# Altium schematic sheet multi-rc522.SchDoc
size A4
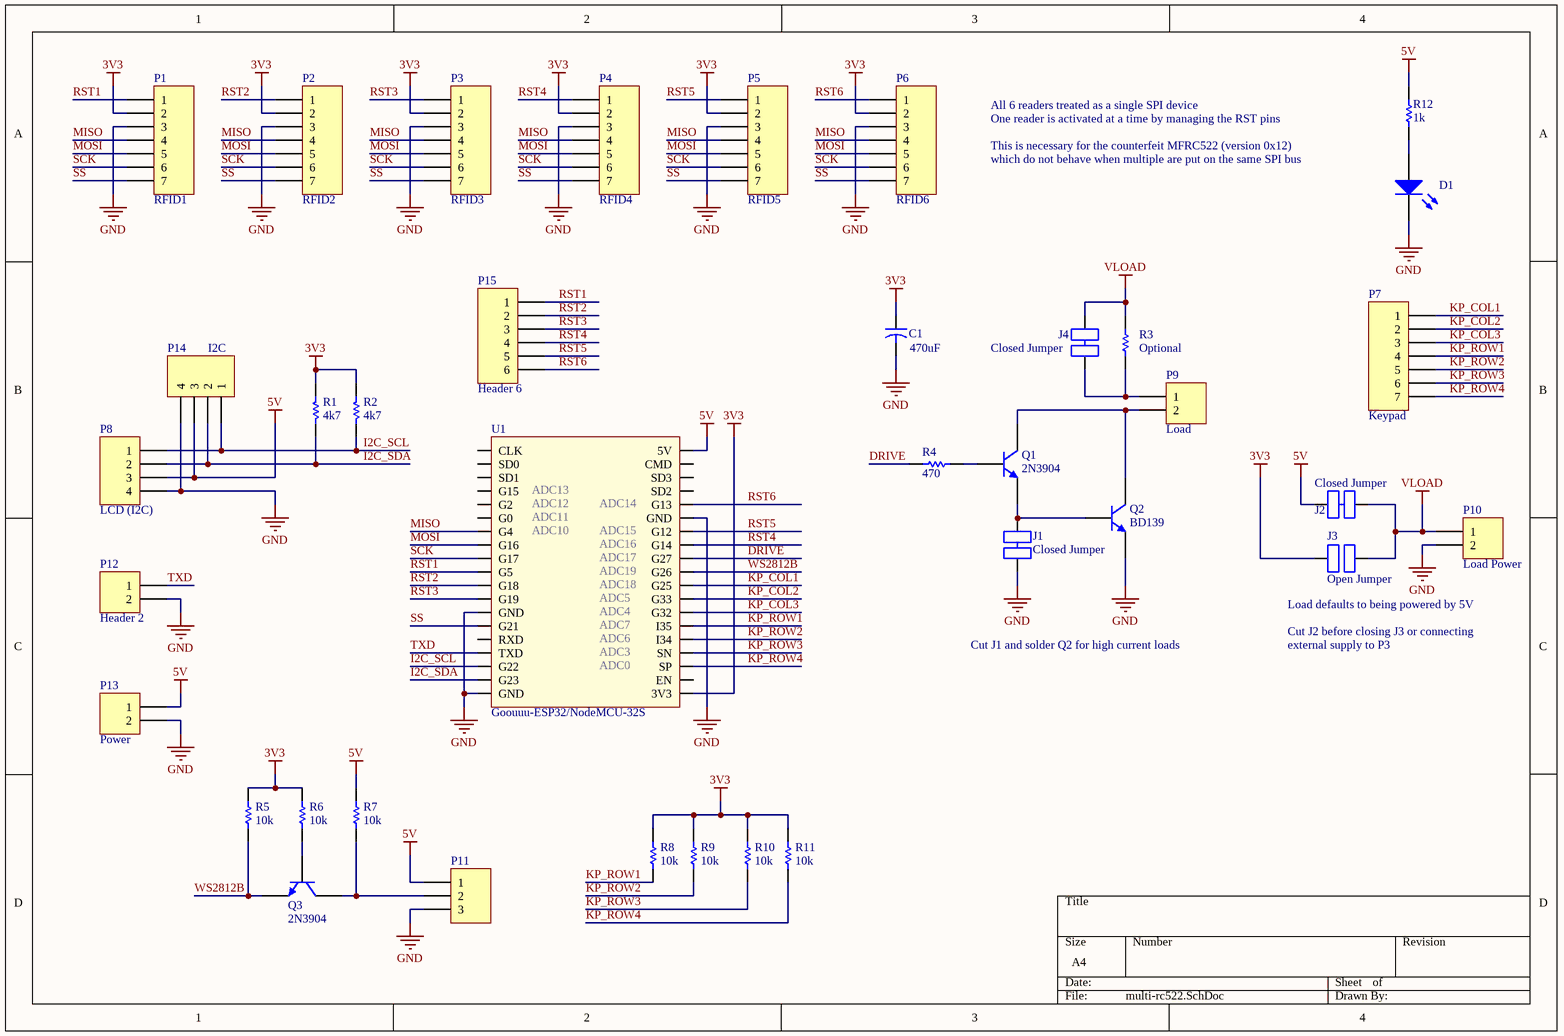
[diagram p0: multi-rc522.SchDoc]

## Parts
C1  value 470uF  [CAPR5-4X5]  (hidden comment: Cap2)
D1  LED  [LED]  (value not drawn)
J1  Closed Jumper  [Jumper (Close)]  (net tie, no BOM)
J2  Closed Jumper  [Jumper (Close)]  (net tie, no BOM)
J3  Open Jumper  [Jumper (Open)]  (no BOM)
J4  Closed Jumper  [Jumper (Close)]  (net tie, no BOM)
P1  RFID1  [HDR1X7]
P2  RFID2  [HDR1X7]
P3  RFID3  [HDR1X7]
P4  RFID4  [HDR1X7]
P5  RFID5  [HDR1X7]
P6  RFID6  [HDR1X7]
P7  Keypad  [HDR1X7]
P8  LCD (I2C)  [HDR1X4]
P9  Load  [RAD-0.2]
P10  Load Power  [RAD-0.2]
P11  Header 3  [HDR1X3]  (value not drawn)
P12  Header 2  [HDR1X2]
P13  Power  [RAD-0.2]
P14  I2C  [HDR1X4]
P15  Header 6  [HDR1X6]
Q1  2N3904  [TO-92A]
Q2  BD139  [TO-220-AB]
Q3  2N3904  [TO-92A]
R1  value 4k7  [AXIAL-0.4]  (hidden comment: Res1)
R2  value 4k7  [AXIAL-0.4]  (hidden comment: Res1)
R3  Optional  [AXIAL-0.4]
R4  value 470  [AXIAL-0.4]  (hidden comment: Res1)
R5  value 10k  [RAD-0.1]  (hidden comment: Res1)
R6  value 10k  [RAD-0.1]  (hidden comment: Res1)
R7  value 10k  [RAD-0.1]  (hidden comment: Res1)
R8  value 10k  [RAD-0.1]  (hidden comment: Res1)
R9  value 10k  [RAD-0.1]  (hidden comment: Res1)
R10  value 10k  [RAD-0.1]  (hidden comment: Res1)
R11  value 10k  [RAD-0.1]  (hidden comment: Res1)
R12  value 1k  [AXIAL-0.4]  (hidden comment: Res1)
U1  Goouuu-ESP32/NodeMCU-32S  [ESP32]

## Nets
3V3: C1.1 J3.1 P1.2 P2.2 P3.2 P4.2 P5.2 P6.2 R1.2 R2.2 R5.2 R6.2 R8.2 R9.2 R10.2 R11.2 U1.20(3V3)
5V: J2.1 P8.3 P11.1 P13.1 P14.3 R7.2 R12.1 U1.38(5V)
GND: C1.2 D1.2(K) J1.2 P1.3 P2.3 P3.3 P4.3 P5.3 P6.3 P8.4 P10.2 P11.3 P12.2 P13.2 P14.4 Q2.1(E) U1.13(GND) U1.19(GND) U1.33(GND)
VLOAD: J2.2 J3.2 J4.2 P10.1 R3.1
DRIVE: R4.2 U1.30(G27)
I2C_SCL: P8.1 P14.1 R2.1 U1.17(G22)
I2C_SDA: P8.2 P14.2 R1.1 U1.18(G23)
KP_COL1: P7.1 U1.28(G25)
KP_COL2: P7.2 U1.27(G33)
KP_COL3: P7.3 U1.26(G32)
KP_ROW1: P7.4 R8.1 U1.25(I35)
KP_ROW2: P7.5 R9.1 U1.24(I34)
KP_ROW3: P7.6 R10.1 U1.23(SN)
KP_ROW4: P7.7 R11.1 U1.22(SP)
MISO: P1.4 P2.4 P3.4 P4.4 P5.4 P6.4 U1.7(G4)
MOSI: P1.5 P2.5 P3.5 P4.5 P5.5 P6.5 U1.8(G16)
RST1: P1.1 P15.1 U1.10(G5)
RST2: P2.1 P15.2 U1.11(G18)
RST3: P3.1 P15.3 U1.12(G19)
RST4: P4.1 P15.4 U1.31(G14)
RST5: P5.1 P15.5 U1.32(G12)
RST6: P6.1 P15.6 U1.34(G13)
SCK: P1.6 P2.6 P3.6 P4.6 P5.6 P6.6 U1.9(G17)
SS: P1.7 P2.7 P3.7 P4.7 P5.7 P6.7 U1.14(G21)
TXD: P12.1 U1.16(TXD)
WS2812B: Q3.1(E) R5.1 U1.29(G26)
NetD1_1: D1.1(A) R12.2
NetJ1_1: J1.1 Q1.1(E) Q2.2(B)
NetJ4_1: J4.1 P9.1 R3.2
NetP9_2: P9.2 Q1.3(C) Q2.3(C)
NetP11_2: P11.2 Q3.3(C) R7.1
NetQ1_2: Q1.2(B) R4.1
NetQ3_2: Q3.2(B) R6.1

Not connected (* = marked no-connect by the designer): U1 1(CLK) 2(SD0) 3(SD1) 4(G15) 5(G2) 6(G0) 15(RXD) 21(EN) 35(SD2) 36(SD3) 37(CMD)

## Notes on the sheet
- All 6 readers treated as a single SPI device
- One reader is activated at a time by managing the RST pins
- This is necessary for the counterfeit MFRC522 (version 0x12)
- which do not behave when multiple are put on the same SPI bus
- Cut J1 and solder Q2 for high current loads
- Load defaults to being powered by 5V
- Cut J2 before closing J3 or connecting
- external supply to P3
- (in symbol ESP32) ADC13; ADC12; ADC14; ADC11; ADC10; ADC15; ADC16; ADC17; ADC19; ADC18; ADC5; ADC4; ADC7; ADC6; ADC3; ADC0

## Library data of the parts
C1 = Cap2: Capacitor; Published: 23-Sep-2002; PackageReference: CAPR5-4X5; Publisher: Altium Limited; PackageDescription: Capacitor; 2 Leads
J1 J2 J4 = Jumper (Closed)
J3 = Jumper (Open)
P1-P7 = Header 7: Header, 7-Pin; LatestRevisionDate: 17-Jul-2002; LatestRevisionNote: Re-released for DXP Platform.; Publisher: Altium Limited
P8 P14 = Header 4: Header, 4-Pin; LatestRevisionDate: 17-Jul-2002; LatestRevisionNote: Re-released for DXP Platform.; Publisher: Altium Limited
P9 P10 P12 P13 = Header 2: Header, 2-Pin; LatestRevisionDate: 17-Jul-2002; LatestRevisionNote: Re-released for DXP Platform.; Publisher: Altium Limited
P11 = Header 3: Header, 3-Pin; LatestRevisionDate: 17-Jul-2002; LatestRevisionNote: Re-released for DXP Platform.; Publisher: Altium Limited
P15 = Header 6: Header, 6-Pin; LatestRevisionDate: 17-Jul-2002; LatestRevisionNote: Re-released for DXP Platform.; Publisher: Altium Limited
Q1 Q3 = 2N3904: NPN General Purpose Amplifier; Published: 8-Jun-2000; LatestRevisionDate: 15-Jan-2003; LatestRevisionNote: PCB Footprint 'BCY-W3/D4.7' replaced; DatasheetVersion: 1997; PackageVersion: Sep-1998; PackageReference: TO-92A; Publisher: Altium Limited; PackageDescription: TO, Flat Index; 3 In-Line, Axial Leads; Body Dia. 4.5mm; Leads 0.51 x 0.48 mm (max); ComponentLink1Description: Manufacturer Link; ComponentLink1URL: http://www.fairchildsemi.com/; ComponentLink2Description: Datasheet; ComponentLink2URL: http://www.fairchildsemi.com/ds/2N%2F2N3904.pdf
Q2 = 2N3904: NPN General Purpose Amplifier; pin to pad: 2>3 3>2; Published: 8-Jun-2000; LatestRevisionDate: 15-Jan-2003; LatestRevisionNote: PCB Footprint 'BCY-W3/D4.7' replaced; DatasheetVersion: 1997; PackageVersion: Sep-1998; PackageReference: TO-92A; Publisher: Altium Limited; PackageDescription: TO, Flat Index; 3 In-Line, Axial Leads; Body Dia. 4.5mm; Leads 0.51 x 0.48 mm (max); ComponentLink1Description: Manufacturer Link; ComponentLink1URL: http://www.fairchildsemi.com/; ComponentLink2Description: Datasheet; ComponentLink2URL: http://www.fairchildsemi.com/ds/2N%2F2N3904.pdf
R1 R2 R4-R12 = Res1: Resistor; Published: 8-Jun-2000; LatestRevisionDate: 17-Jul-2002; LatestRevisionNote: Re-released for DXP Platform.; PackageReference: AXIAL-0.3; Publisher: Altium Limited; PackageDescription: Axial Device, Thru-Hole; 2 Leads; 0.3 in Pin Spacing
R3 = Res1: Resistor; Value: 330; Published: 8-Jun-2000; LatestRevisionDate: 17-Jul-2002; LatestRevisionNote: Re-released for DXP Platform.; PackageReference: AXIAL-0.3; Publisher: Altium Limited; PackageDescription: Axial Device, Thru-Hole; 2 Leads; 0.3 in Pin Spacing
U1 = ESP32
D1 = LED: Published: 8-Jun-2000; LatestRevisionDate: 17-Jul-2002; LatestRevisionNote: Re-released for DXP Platform.; PackageVersion: Feb-2002; PackageReference: 3.2X1.6X1.1; Publisher: Altium Limited; PackageDescription: SM LED; 2 Flat Leads